# EAGLE schematic freiBot (EAGLE 6.5.0)
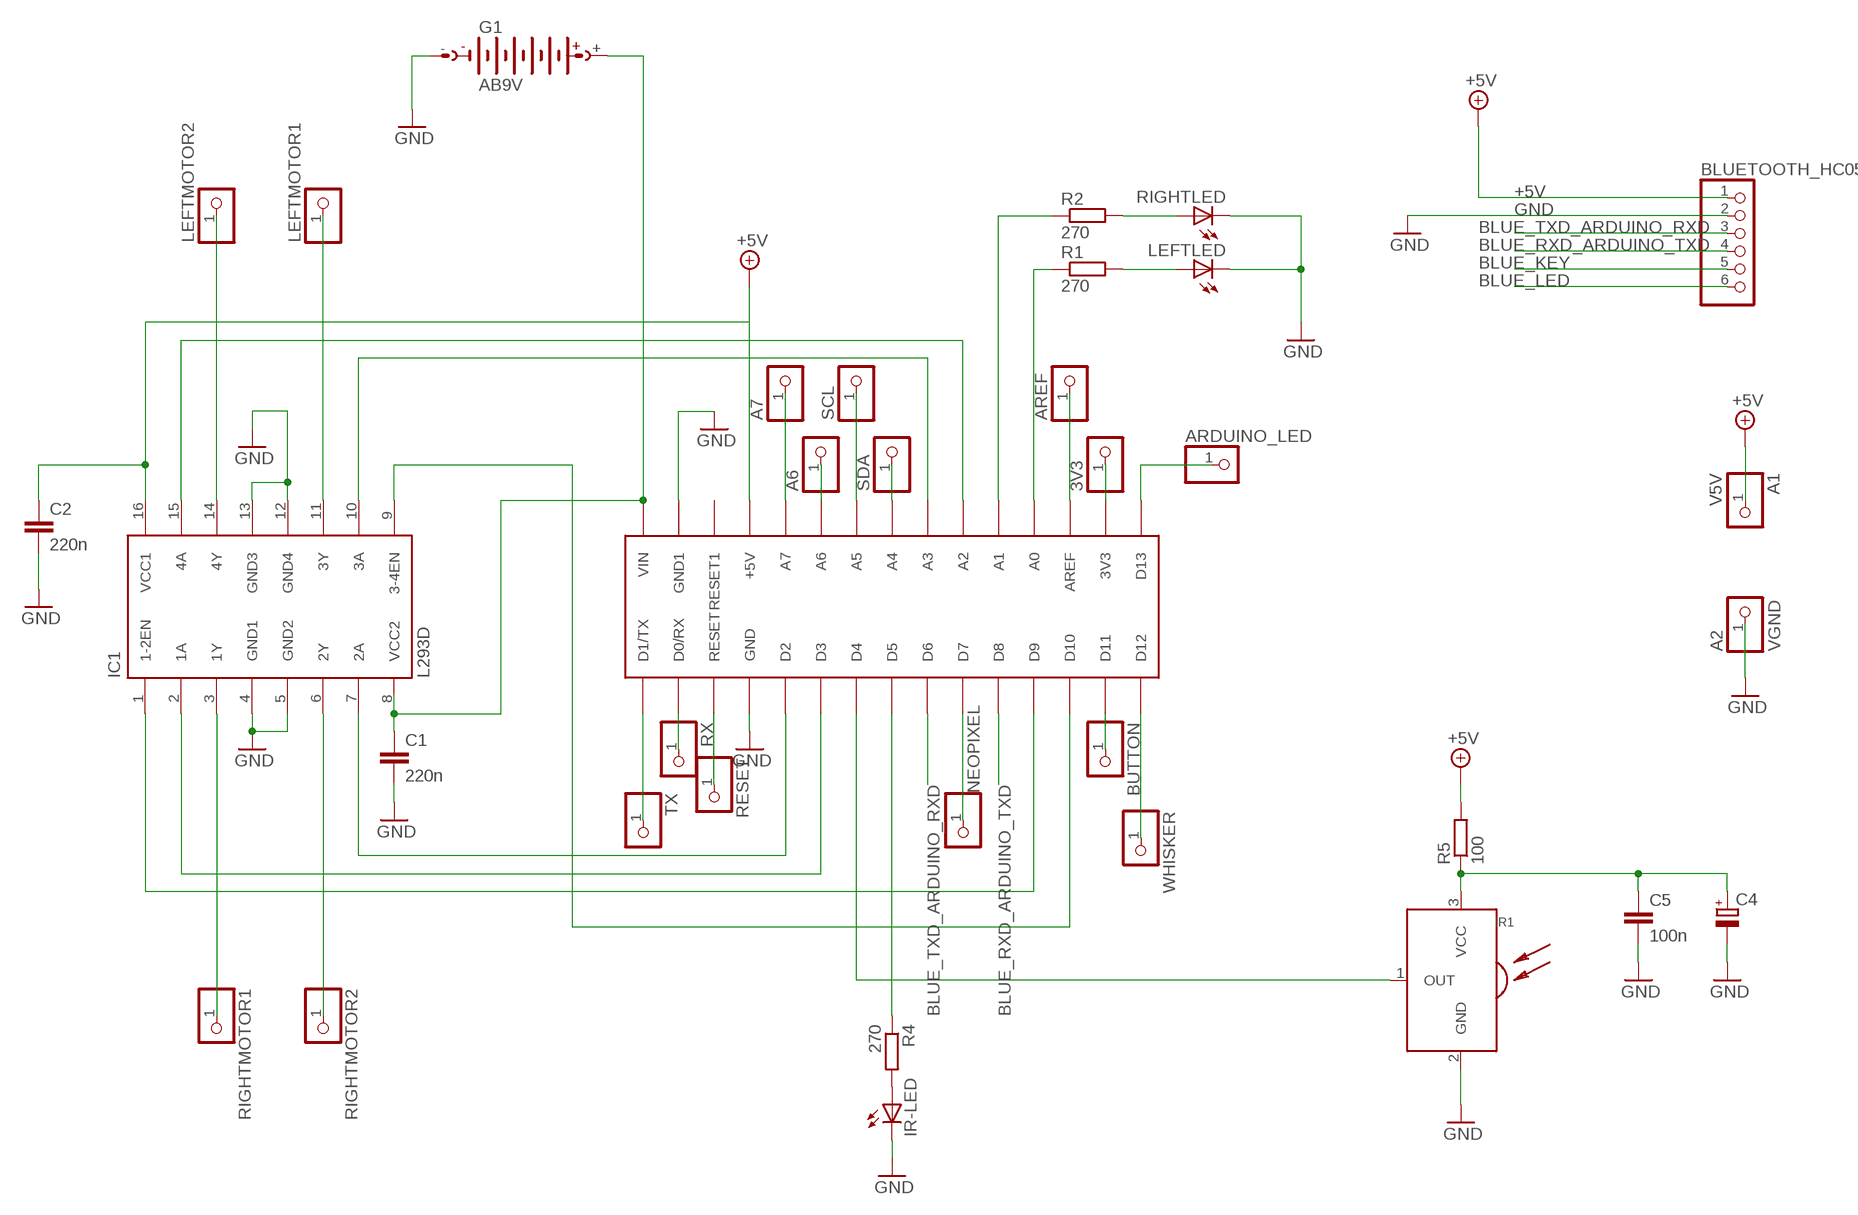
[diagram p0: schematic, sheet 1]

## Parts
3V3  PINHD-1X1  [1X01]
A1  V5V  PINHD-1X1  [1X01]
A2  VGND  PINHD-1X1  [1X01]
A6  PINHD-1X1  [1X01]
A7  PINHD-1X1  [1X01]
ARDUINO_LED  PINHD-1X1  [1X01]
AREF  PINHD-1X1  [1X01]
BLUETOOTH_HC05  PINHD-1X6  [1X06]
BUTTON  PINHD-1X1  [1X01]
C1  220n  C-EU075-042X103  [C075-042X103]
C2  220n  C-EU075-042X103  [C075-042X103]
C4  CPOL-EUE5-8.5  [E5-8,5]
C5  100n  C-EU050-025X075  [C050-025X075]
G1  AB9V  [AB9V]
IC1  L293D  [DIL16]
IR1  SFH5110  [SFH511*]
IR-LED  LED5MM  [LED5MM]
LEFTLED  LED10MM  [LED10MM]
LEFTMOTOR1  PINHD-1X1  [1X01]
LEFTMOTOR2  PINHD-1X1  [1X01]
NEOPIXEL  PINHD-1X1  [1X01]
R1  270  R-EU_0309/12  [0309/12]
R2  270  R-EU_0309/12  [0309/12]
R4  270  R-EU_0309/12  [0309/12]
R5  100  R-EU_0309/10  [0309/10]
RESET  PINHD-1X1  [1X01]
RIGHTLED  LED10MM  [LED10MM]
RIGHTMOTOR1  PINHD-1X1  [1X01]
RIGHTMOTOR2  PINHD-1X1  [1X01]
RX  PINHD-1X1  [1X01]
SCL  PINHD-1X1  [1X01]
SDA  PINHD-1X1  [1X01]
TX  PINHD-1X1  [1X01]
U$1  ARDUINONANO  [PDIP-32]
WHISKER  PINHD-1X1  [1X01]

## Nets
+5V: A1.1 BLUETOOTH_HC05.1 C2.1 IC1.16(VCC1) R5.2 U$1.+5V
BLUE_KEY: BLUETOOTH_HC05.5
BLUE_LED: BLUETOOTH_HC05.6
BLUE_RXD_ARDUINO_TXD: BLUETOOTH_HC05.4 U$1.D8
BLUE_TXD_ARDUINO_RXD: BLUETOOTH_HC05.3 U$1.D6
GND: A2.1 BLUETOOTH_HC05.2 C1.2 C2.2 C4.- C5.2 G1.- IC1.4(GND1) IC1.5(GND2) IC1.12(GND4) IC1.13(GND3) IR1.2(GND) IR-LED.K(C) LEFTLED.K(C) RIGHTLED.K(C) U$1.GND U$1.GND1
N$1: IC1.7(2A) U$1.D2
N$2: IC1.2(1A) U$1.D3
N$3: IC1.1(1-2EN) U$1.D9
N$4: IC1.3(1Y) RIGHTMOTOR1.1
N$5: IC1.9(3-4EN) U$1.D10
N$6: IC1.10(3A) U$1.A3
N$7: IC1.15(4A) U$1.A2
N$8: IC1.6(2Y) RIGHTMOTOR2.1
N$9: IC1.11(3Y) LEFTMOTOR1.1
N$10: IC1.14(4Y) LEFTMOTOR2.1
N$11: C1.1 G1.+ IC1.8(VCC2) U$1.VIN
N$12: IR-LED.A R4.2
N$13: R1.1 U$1.A0
N$14: R2.1 U$1.A1
N$15: R2.2 RIGHTLED.A
N$16: LEFTLED.A R1.2
N$17: SDA.1 U$1.A4
N$18: SCL.1 U$1.A5
N$19: ARDUINO_LED.1 U$1.D13
N$20: U$1.D12 WHISKER.1
N$21: BUTTON.1 U$1.D11
N$22: NEOPIXEL.1 U$1.D7
N$23: IR1.1(OUT) U$1.D4
N$24: R4.1 U$1.D5
N$25: A6.1 U$1.A6
N$26: 3V3.1 U$1.3V3
N$27: AREF.1 U$1.AREF
N$28: A7.1 U$1.A7
N$29: RESET.1 U$1.RESET
N$30: TX.1 U$1.D1/TX
N$31: RX.1 U$1.D0/RX
VCC: C4.+ C5.1 IR1.3(VCC) R5.1
Unconnected: U$1.RESET1

## Library data of the parts
3V3 A1 A2 A6 A7 ARDUINO_LED AREF BUTTON LEFTMOTOR1 LEFTMOTOR2 NEOPIXEL RESET RIGHTMOTOR1 RIGHTMOTOR2 RX SCL SDA TX WHISKER = pinhead:PINHD-1X1: PIN HEADER
BLUETOOTH_HC05 = pinhead:PINHD-1X6: PIN HEADER
C1 C2 C5 = rcl:C-EU: CAPACITOR, European symbol
C4 = rcl:CPOL-EU: POLARIZED CAPACITOR, European symbol
G1 = battery:AB9V: 9-V BATTERY CLIP
IC1 = st-microelectronics:L293D: PUSH-PULL 4 CHANNEL DRIVER; MPN: L293D; OC_FARNELL: 9589619; OC_NEWARK: 56P8249
IR1 = 0-svo:SFH511*: SFH 5110 and SFH 5111 are IR receivers to detect light from infrared remote control systems. The IC includes photodiode, preamplifier, automatic gain control, bandpass and demodulator. The black-colored package is designed as daylight- cutoff filter.
IR-LED = 0-svo:LED: LED
LEFTLED RIGHTLED = led:LED: LED
R1 R2 R4 R5 = rcl:R-EU_: RESISTOR, European symbol
U$1 = jet-lib:ARDUINONANO